# Altium schematic sheet User_USB.SchDoc: User_USB
size A4; Date: Not used; ApprovedBy: Not used; CheckedBy: Not used; Author: Not used; CompanyName: STMicroelectronics; DrawnBy: Not used; Engineer: Not used; Organization: Not used; Address1: Not used; Address2: Not used; Address3: Not used; Address4: Not used; DocumentNumber: 7; Revision: Not used; SheetNumber: 7; SheetTotal: 8; CurrentTime: Not used; CurrentDate: Not used; Time: Not used; DocumentFullPathAndName: Not used; DocumentName: Not used; ModifiedDate: Not used; ImagePath: Not used; ProjectName: Not used; Application_BuildNumber: Not used
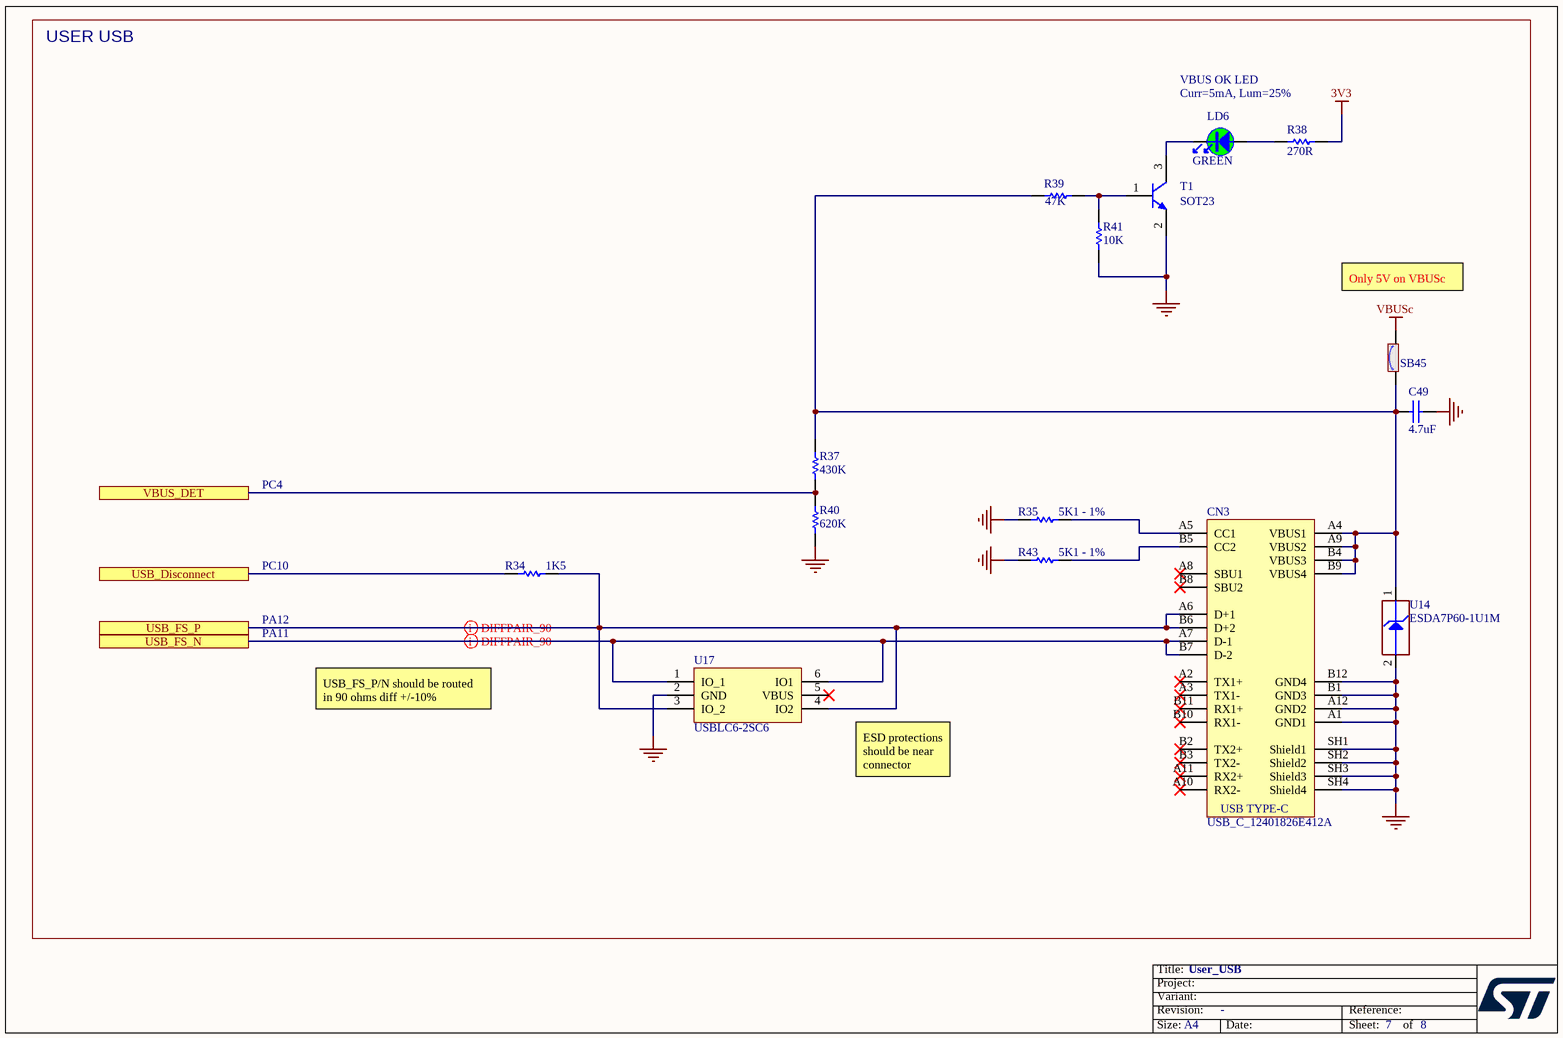
[diagram p0: User_USB.SchDoc]

## Parts
C49  value 4.7uF  [C0603]  (hidden comment: Capacitor)
CN3  value USB_C_12401826E412A  [CON_USB-TYPEC_AMPHENOL_12401826E412A]  (hidden comment: USB_TYPE_C_Receptacle)
LD6  value GREEN  [LED_0603_OSRAM_LG-Q396-PS-35_GREEN_1A2K_H0P4]  (hidden comment: LED_green)
R34  value 1K5  [R0603]  (hidden comment: Resistor)
R35  value 5K1 - 1%  [R0603]  (hidden comment: Resistor)
R37  value 430K  [R0603]  (hidden comment: Resistor)
R38  value 270R  [R0402]  (hidden comment: Resistor)
R39  value 47K  [R0402]  (hidden comment: Resistor)
R40  value 620K  [R0603]  (hidden comment: Resistor)
R41  value 10K  [R0402]  (hidden comment: Resistor)
R43  value 5K1 - 1%  [R0603]  (hidden comment: Resistor)
SB45  (no value)  [SOLDER-BRIDGE_R0603-0R]
T1  value SOT23  [NPN_SOT23]  (hidden comment: 9013-SOT23)
U14  value ESDA7P60-1U1M  [ESD_QFN2_1P6X1_P125]  (hidden comment: ESD-TRANSIL)
U17  USBLC6-2SC6  [ESD_SOT23-6L]

## Ports
USB_Disconnect, USB_FS_N, USB_FS_P, VBUS_DET

## Nets
3V3: R38.2
GND: C49.1 CN3.A1(GND1) CN3.A12(GND2) CN3.B1(GND3) CN3.B12(GND4) CN3.SH1(Shield1) CN3.SH2(Shield2) CN3.SH3(Shield3) CN3.SH4(Shield4) R35.1 R40.1 R41.1 R43.1 T1.2(E) U14.2(GND) U17.2(GND)
VBUSc: SB45.2
USB_Disconnect: R34.1 ; port USB_Disconnect
USB_FS_N: CN3.A7(D-1) CN3.B7(D-2) U17.1(IO_1) U17.6(IO1) ; port USB_FS_N
USB_FS_P: CN3.A6(D+1) CN3.B6(D+2) R34.2 U17.3(IO_2) U17.4(IO2) ; port USB_FS_P
VBUS_DET: R37.1 R40.2 ; port VBUS_DET
NetC49_2: C49.2 CN3.A4(VBUS1) CN3.A9(VBUS2) CN3.B4(VBUS3) CN3.B9(VBUS4) R37.2 R39.1 SB45.1 U14.1(IO1)
NetCN3_A5: CN3.A5(CC1) R35.2
NetCN3_B5: CN3.B5(CC2) R43.2
NetLD6_1: LD6.1 R38.1
NetLD6_2: LD6.2 T1.3(C)
NetR39_2: R39.2 R41.2 T1.1(B)

Not connected (* = marked no-connect by the designer): CN3 A2(TX1+)* A3(TX1-)* A8(SBU1)* A10(RX2-)* A11(RX2+)* B2(TX2+)* B3(TX2-)* B8(SBU2)* B10(RX1-)* B11(RX1+)*; U17 5(VBUS)*

## Layout directives
differential pair: USB_FS_N, USB_FS_P

## Notes on the sheet
- USER USB
- VBUS OK LED
- Curr=5mA, Lum=25%
- Only 5V on VBUSc
- PC4
- PC10
- PA11
- PA12
- USB_FS_P/N should be routed in 90 ohms diff +/-10%
- ESD protections should be near connector
- Title:
- Project:
- Size:
- Revision:
- Variant:
- A4
- -
- Date:
- Reference:
- Sheet:
- of
- (in symbol MCD-03232) USB TYPE-C

## Library data of the parts
C49 = MCD-00009: Capacitor, MLCC, 4.7uF, 16V, X5R, 10%, 0603, T=0.8mm; Manufacturer_Part_Number: CC0603KRX5R7BB475; Manufacturer: YAGEO; Provided_By: SUBCO; ECCN_US: EAR99; ECCN_EU: NEC; Internal_Part_Number: MCD-00009; ComponentLink1Description: Datasheet; Status: Released; Package: C0603; Part_Type: Capacitor; ComponentLink1URL: http://tunmcdsvn.tun.st.com/Component_Datasheet_Library/Trunk/Capacitors/Yageo_Multilayer_capacitor_X5R_series_100pF_to_100uF
CN3 = MCD-03232: USB_TypeC, 24 pins, RA, SMD, T=2.96mm; Part_Type: Connector; Part_Preference: Recommended; Manufacturer: AMPHENOL ICC; Manufacturer_Part_Number: 12401826E412A; Component_Country_Of_Origin: China°; ShowFields: YES; ID: 5348; Internal_Part_Number: MCD-03232; Status: Released; ComponentLink1URL: http://tunmcdsvn.tun.st.com/Component_Documentation_Library/Trunk/Connector/AMPHEMOL_ICC_12401826E412A; Order_Code_Digikey: 12401826E412ATR-ND; Order_Code_Farnell: 3727763; Order_Code_RS: N/A
LD6 = MCD-00588: LED Green, 0603 SMD, Forward Voltage Typ=2V, Max=2.5V; Part_Type: Display; Manufacturer_Part_Number: LG Q396-PS-35; Manufacturer: OSRAM OPTO SEMICONDUCTORS; Alternate_Manufacturer_Part_Number: VLMTG1300-GS08; Alternate_Manufacturer: VISHAY SEMICONDUCTOR OPTO DIVISION; Provided_By: SUBCO; Internal_Part_Number: MCD-00588; Status: Released; Package: LED 0603; ComponentLink1Description: Datasheet; ComponentLink1URL: http://tunmcdsvn.tun.st.com/Component_Datasheet_Library/Trunk/Display/OSRAM_LED_GREEN_LG Q396-PS-35; Order_Code_Digikey: LG Q396-PS-35-ND; ECCN_US: n/a; ECCN_EU: n/a
R34 = MCD-00217: Resistor, 1K5, 0603, +/-1%, 1/10W; BMS_Part_Number: 9129766; Part_Preference: Recommended; Manufacturer: YAGEO; Manufacturer_Part_Number: RC0603FR-071K5L; Component_Country_Of_Origin: China; ShowFields: YES; ID: 2651; Internal_Part_Number: MCD-00217; Status: Released; Part_Type: Resistor; Package: 0603; ComponentLink1URL: http://tunmcdsvn.tun.st.com/Component_Documentation_Library/Trunk/Resistor/YAGEO_RC_L_Series; Order_Code_Digikey: 311-1.50KHRCT-ND; Order_Code_Farnell: 9238506; Order_Code_RS: N/A
R35 R43 = MCD-00334: Resistor, 5K1, 0603, +/-1%, 1/10W; Part_Preference: Recommended; Manufacturer: YAGEO; Manufacturer_Part_Number: RC0603FR-075K1L; Internal_Part_Number: MCD-00334; Status: Released; Part_Type: Resistor; Alternate_Manufacturer: N/A; Alternate_Manufacturer_Part_Number: N/A; Package: 0603; ComponentLink1URL: http://tunmcdsvn.tun.st.com/Component_Documentation_Library/Trunk/Resistor/YAGEO_RC_L_Series; Order_Code_Digikey: 311-5.10KHRCT-ND; Order_Code_Farnell: 1799348; Order_Code_RS: N/A
R37 = MCD-00480: Resistor, 430K, 0603, +/-1%, 1/10W; Part_Preference: Recommended; Manufacturer: YAGEO; Manufacturer_Part_Number: RC0603FR-07430KL; Component_Country_Of_Origin: China; ShowFields: YES; ID: 2798; Internal_Part_Number: MCD-00480; Status: Released; Part_Type: Resistor; Package: 0603; ComponentLink1URL: http://tunmcdsvn.tun.st.com/Component_Documentation_Library/Trunk/Resistor/YAGEO_RC_L_Series; Order_Code_Digikey: 311-430KHRCT-ND; Order_Code_Farnell: N/A; Order_Code_RS: N/A
R38 = MCD-00441: Resistor,270R,0402,1%,1/16W; Manufacturer_Part_Number: RC0402FR-07270RL; Manufacturer: YAGEO; Provided_By: SUBCO; ECCN_US: EAR99; ECCN_EU: NEC; Internal_Part_Number: MCD-00441; Status: Released; Part_Type: Resistor; Package: R0402; ComponentLink1Description: Datasheet; ComponentLink1URL: http://tunmcdsvn.tun.st.com/Component_Datasheet_Library/Trunk/Resistors/Yageo_Resistor_RC0402-series
R39 = MCD-00063: Resistor,47K,0402,1%,1/16W; Manufacturer_Part_Number: RC0402FR-0747KL; Manufacturer: YAGEO; Provided_By: SUBCO; ECCN_US: EAR99; ECCN_EU: NEC; Internal_Part_Number: MCD-00063; ComponentLink1Description: Datasheet; Status: Released; Part_Type: Resistor; Package: R0402; ComponentLink1URL: http://tunmcdsvn.tun.st.com/Component_Datasheet_Library/Trunk/Resistors/Yageo_Resistor_RC0402-series
R40 = MCD-00506: Resistor, 620K, 0603, +/-1%, 1/10W; Part_Preference: Recommended; Manufacturer: YAGEO; Manufacturer_Part_Number: RC0603FR-07620KL; Component_Country_Of_Origin: China; ShowFields: YES; ID: 3237; Internal_Part_Number: MCD-00506; Status: Released; Part_Type: Resistor; Package: 0603; ComponentLink1URL: http://tunmcdsvn.tun.st.com/Component_Documentation_Library/Trunk/Resistor/YAGEO_RC_L_Series; Order_Code_Digikey: 311-620KHRCT-ND; Order_Code_Farnell: N/A; Order_Code_RS: N/A
R41 = MCD-00053: Resistor,10K,0402,1%,1/16W; Manufacturer_Part_Number: RC0402FR-0710KL; Manufacturer: YAGEO; Provided_By: SUBCO; ECCN_US: EAR99; ECCN_EU: NEC; Internal_Part_Number: MCD-00053; Status: Released; ComponentLink1Description: Datasheet; Part_Type: Resistor; Package: R0402; ComponentLink1URL: http://tunmcdsvn.tun.st.com/Component_Datasheet_Library/Trunk/Resistors/Yageo_Resistor_RC0402-series
SB45 = MCD-00071: Solder Bridge ON; Part_Type: Mechanical; Manufacturer_Part_Number: RC0603JR-070RL; Manufacturer: YAGEO; Provided_By: SUBCO; Internal_Part_Number: MCD-00071; ECCN_US: n/a; ECCN_EU: n/a; Status: Released; Package: SB0603; ComponentLink1Description: Datasheet; ComponentLink1URL: http://tunmcdsvn.tun.st.com/Component_Datasheet_Library/Trunk/Resistors/Yageo_Resistor_RC0603-series
T1 = MCD-00073: NPN Bipolar Transistor; Manufacturer_Part_Number: BSR14; Manufacturer: ON SEMICONDUCTOR; Part_Type: IC; Alternate_Manufacturer_Part_Number: MMBT2222ALT1G / MMBT2222ALT3G; Provided_By: SUBCO; ECCN_US: EAR99; ECCN_EU: NEC; Revision: *; Internal_Part_Number: MCD-00073; ComponentLink1Description: Datasheet; Status: Released; ComponentLink1URL: http://tunmcdsvn.tun.st.com/Component_Datasheet_Library/Trunk/IC/NXP_Transistor_BSR14; Alternate_Manufacturer: ON SEMICONDUCTOR
U14 = MCD-00251: High power transient voltage suppressor, 7V breakdown; BMS_Part_Number: 9179042; Part_Type: Diode; Part_Preference: Recommended; Manufacturer: STMICROELECTRONICS; Manufacturer_HQ_COO: EU; Internal_Part_Number: MCD-00251; Status: Released; Manufacturer_Part_Number: ESDA7P60-1U1M; ComponentLink1URL: http://tunmcdsvn.tun.st.com/Component_Datasheet_Library/Trunk/Diodes/STM_ESD_ESDA7P60-1U1M
U17 = MCD-00163: Very low capacitance ESD protection; Part_Type: IC; Manufacturer: STMICROELECTRONICS; BMS_Part_Number: 9151075; Provided_By: SUBCO with ST control; ECCN_US: EAR99; ECCN_EU: NEC; Internal_Part_Number: MCD-00163; Value: USBLC6-2SC6; Status: Released; Manufacturer_Part_Number: USBLC6-2SC6; ComponentLink1Description: Datasheet; ComponentLink1URL: http://tunmcdsvn.tun.st.com/Component_Datasheet_Library/Trunk/Diodes/STM_ESD_USBLC6-2